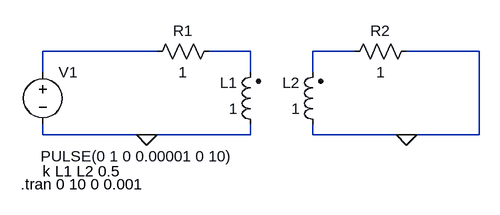
[diagram p0: schematic Simulacion.asc]
Simulacion.asc, the LTspice schematic file:
Version 4
SHEET 1 880 680
WIRE 64 144 -112 144
WIRE 208 144 144 144
WIRE 368 144 304 144
WIRE 560 144 448 144
WIRE -112 176 -112 144
WIRE 208 176 208 144
WIRE 304 176 304 144
WIRE -112 272 -112 256
WIRE 48 272 -112 272
WIRE 208 272 208 256
WIRE 208 272 48 272
WIRE 304 272 304 256
WIRE 448 272 304 272
WIRE 560 272 560 144
WIRE 560 272 448 272
FLAG 48 272 0
FLAG 448 272 0
SYMBOL res 48 160 R270
WINDOW 0 32 56 VTop 2
WINDOW 3 0 56 VBottom 2
SYMATTR InstName R1
SYMATTR Value 1
SYMBOL res 352 160 R270
WINDOW 0 32 56 VTop 2
WINDOW 3 0 56 VBottom 2
SYMATTR InstName R2
SYMATTR Value 1
SYMBOL ind2 224 272 R180
WINDOW 0 36 80 Left 2
WINDOW 3 36 40 Left 2
SYMATTR InstName L1
SYMATTR Value 1
SYMBOL ind2 320 272 R180
WINDOW 0 36 80 Left 2
WINDOW 3 36 40 Left 2
SYMATTR InstName L2
SYMATTR Value 1
SYMBOL voltage -112 160 R0
WINDOW 3 -3 145 Left 2
WINDOW 123 0 0 Left 0
WINDOW 39 0 0 Left 0
SYMATTR InstName V1
SYMATTR Value PULSE(0 1 0 0.00001 0 10)
TEXT -112 328 Left 2 !k L1 L2 0.5
TEXT -146 348 Left 2 !.tran 0 10 0 0.001

The netlist it stands for:
* Simulacion.asc
R1 N001 N002 1
R2 N003 0 1
L1 0 N002 1
L2 0 N003 1
V1 N001 0 PULSE(0 1 0 0.00001 0 10)
k L1 L2 0.5
.tran 0 10 0 0.001
.backanno
.end